# Altium project PCB_Project.PrjPcb
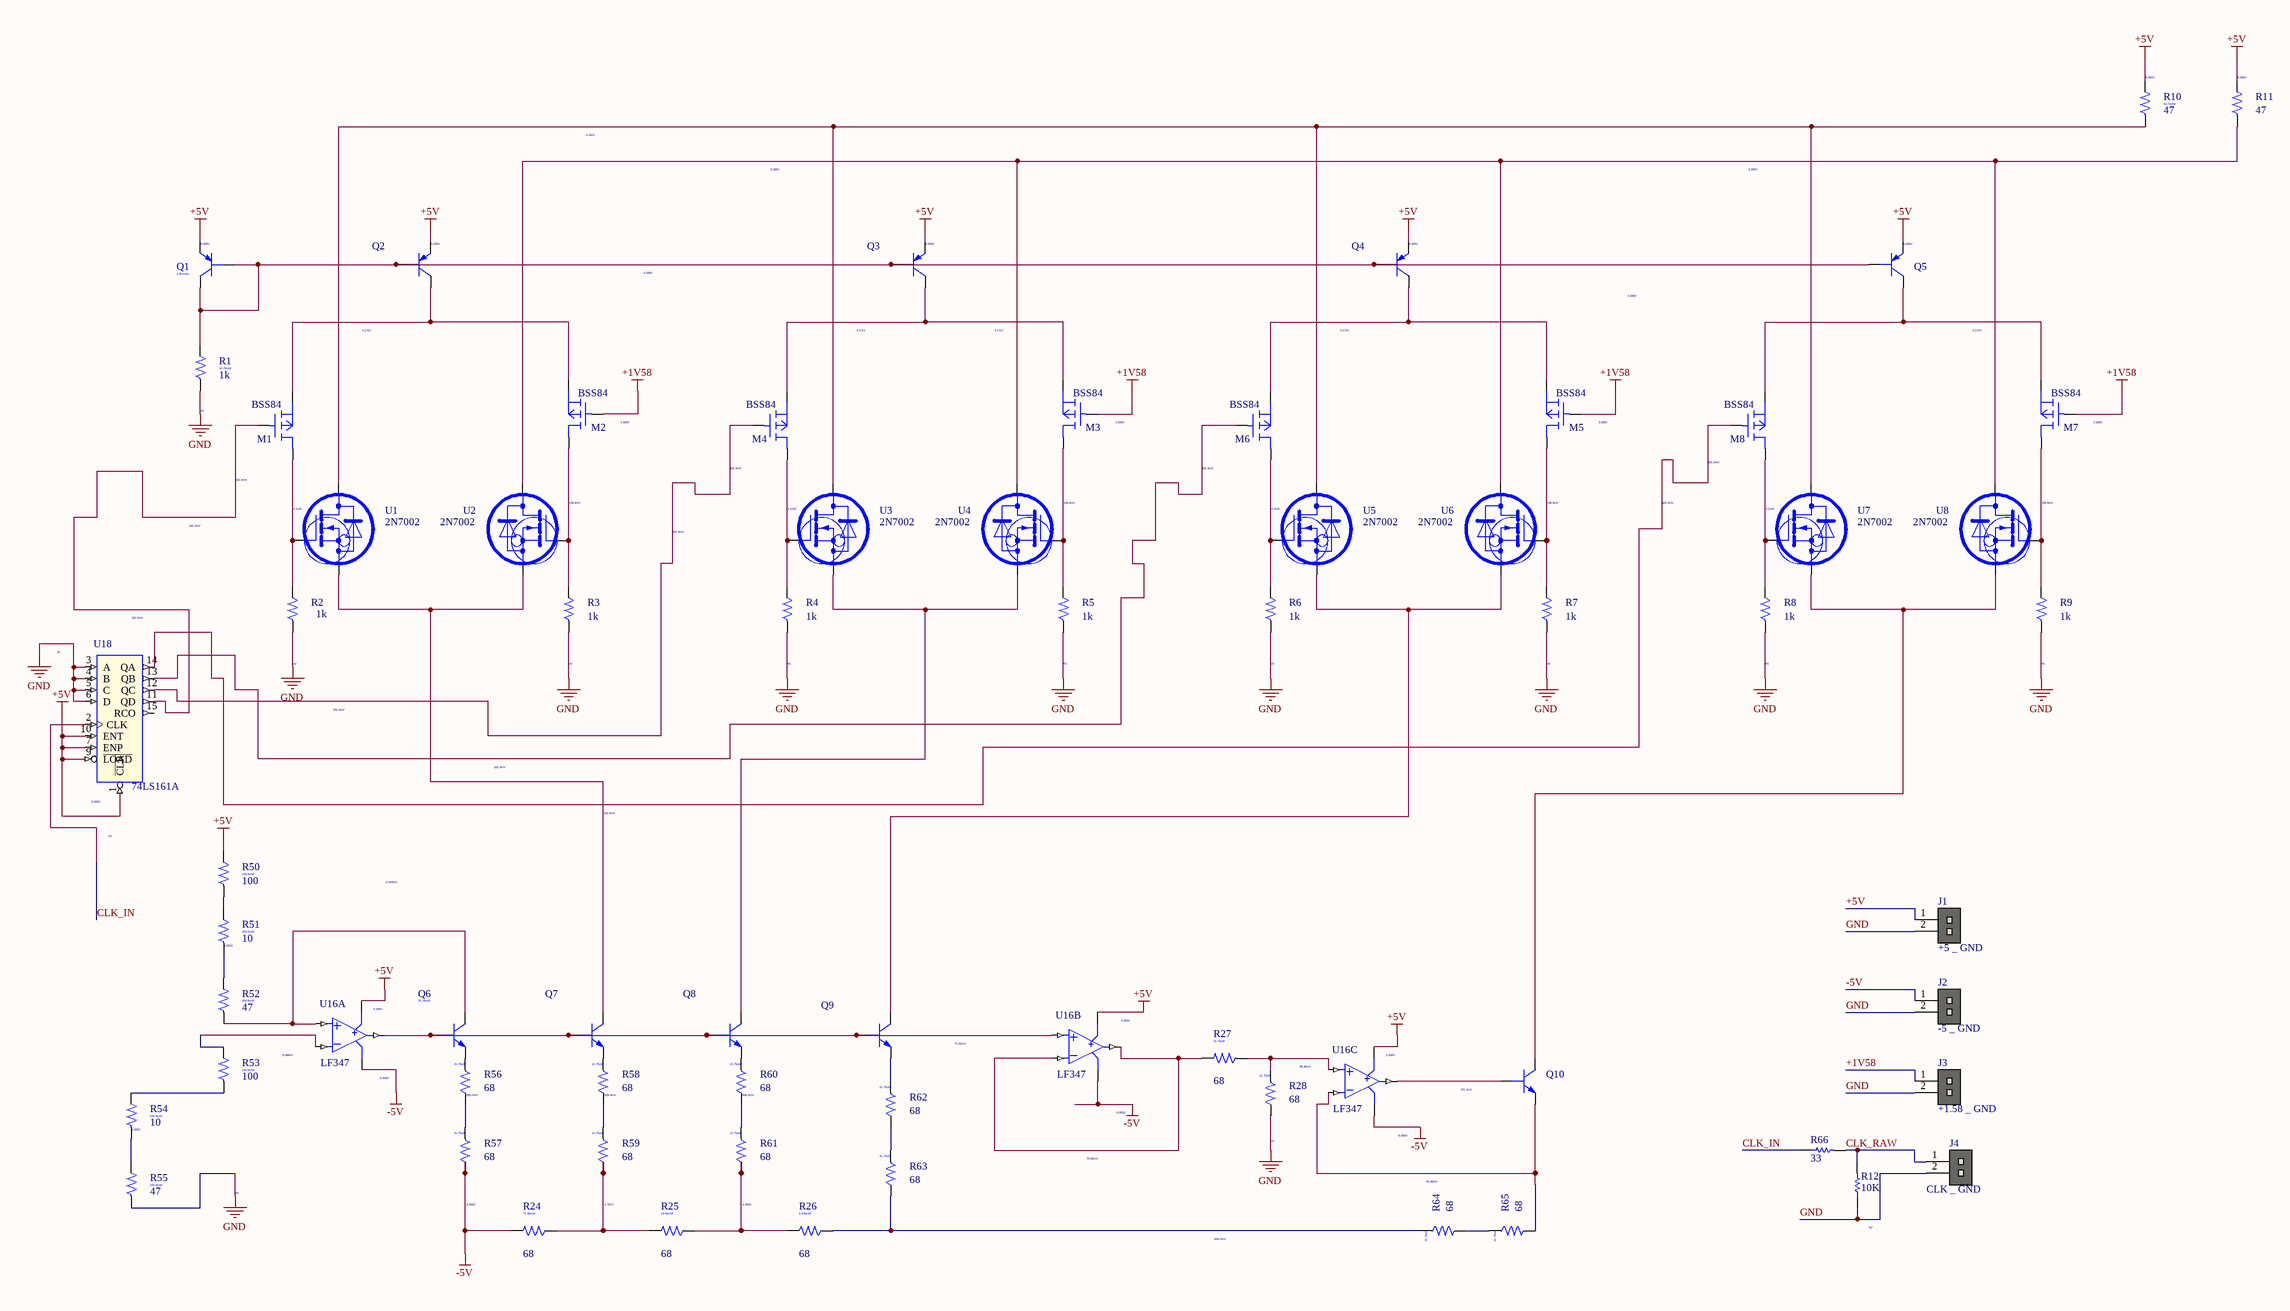
[diagram p0: PAGE1.SchDoc]
1 sheet, 66 parts. Net scope: global (net labels, ports and power ports of the same name join across sheets).
Board file: PCB1.PcbDoc

## Sheet PAGE1.SchDoc
size 513 x 386 mm; SheetNumber: 1; SheetTotal: 1

### Parts
J1  +5 _ GND  [MHDR1X02-254P]
J2  -5 _ GND  [MHDR1X02-254P]
J3  +1.58 _ GND  [MHDR1X02-254P]
J4  CLK _ GND  [MHDR1X02-254P]
M1  BSS84  [SOT-23]
M2  BSS84  [SOT-23]
M3  BSS84  [SOT-23]
M4  BSS84  [SOT-23]
M5  BSS84  [SOT-23]
M6  BSS84  [SOT-23]
M7  BSS84  [SOT-23]
M8  BSS84  [SOT-23]
Q1  BiasValue Power: 2.857mW  [SOT-23]  (hidden comment: BC857)
Q2  BC857  [SOT-23]  (value not drawn)
Q3  BC857  [SOT-23]  (value not drawn)
Q4  BC857  [SOT-23]  (value not drawn)
Q5  BC857  [SOT-23]  (value not drawn)
Q6  BiasValue Power: 20.78mW  [SOT-23]  (hidden comment: BC847)
Q7  BC847  [SOT-23]  (value not drawn)
Q8  BC847  [SOT-23]  (value not drawn)
Q9  BC847  [SOT-23]  (value not drawn)
Q10  BC847  [SOT-23]  (value not drawn)
R1  1k  BiasValue Power: 18.75mW  [R0603]
R2  1k  [R0603]
R3  1k  [R0603]
R4  1k  [R0603]
R5  1k  [R0603]
R6  1k  [R0603]
R7  1k  [R0603]
R8  1k  [R0603]
R9  1k  [R0603]
R10  47  BiasValue Power: 53.73mW  [R0805]
R11  47  [R0805]
R12  10K  [RESC3413X04N]
R24  68  BiasValue Power: 73.36mW  [R0805]
R25  68  BiasValue Power: 19.96mW  [R0805]
R26  68  BiasValue Power: 6.548mW  [R0805]
R27  68  BiasValue Power: 21.75uW  [R0805]
R28  68  BiasValue Power: 21.75uW  [R0805]
R50  100  BiasValue Power: 159.6mW  [R1206]
R51  10  BiasValue Power: 159.6mW  [R0805]
R52  47  BiasValue Power: 159.6mW  [R0805]
R53  100  BiasValue Power: 159.6mW  [R1206]
R54  10  BiasValue Power: 159.6mW  [R0805]
R55  47  BiasValue Power: 159.6mW  [R0805]
R56  68  BiasValue Power: 21.75uW  [R0805]
R57  68  BiasValue Power: 21.75uW  [R0805]
R58  68  BiasValue Power: 21.75uW  [R0805]
R59  68  BiasValue Power: 21.75uW  [R0805]
R60  68  BiasValue Power: 21.75uW  [R0805]
R61  68  BiasValue Power: 21.75uW  [R0805]
R62  68  BiasValue Power: 21.75uW  [R0805]
R63  68  BiasValue Power: 21.75uW  [R0805]
R64  68  BiasValue Power: 21.75uW  [R0805]
R65  68  BiasValue Power: 21.75uW  [R0805]
R66  value 33  [SMD-0805-RES]  (hidden comment: Resistor SMD 0805)
U1  2N7002  [SOT-23]
U2  2N7002  [SOT-23]
U3  2N7002  [SOT-23]
U4  2N7002  [SOT-23]
U5  2N7002  [SOT-23]
U6  2N7002  [SOT-23]
U7  2N7002  [SOT-23]
U8  2N7002  [SOT-23]
U16  LF347  [DIP14]  (parts A,B,C of 4)
U18  74LS161A  [DIP 16]

### Nets
+1V58: J3.1 M2.1(g) M3.1(g) M5.1(g) M7.1(g)
+5V: J1.1 Q1.1(E) Q2.1(E) Q3.1(E) Q4.1(E) Q5.1(E) R10.2 R11.2 R50.2 U16.4(PVSS) U16.PVSS U18.1(~{CLR}) U18.7(ENP) U18.9(~{LOAD}) U18.10(ENT)
-5V: J2.1 R24.2 R57.2 U16.11(NVSS) U16.NVSS
GND: J1.2 J2.2 J3.2 J4.2 R1.1 R2.1 R3.1 R4.1 R5.1 R6.1 R7.1 R8.1 R9.1 R12.1 R28.2 R55.1 U18.3(A) U18.4(B) U18.5(C) U18.6(D)
CLK_IN: R66.1 U18.2(CLK)
CLK_RAW: J4.1 R12.2 R66.2
NetM1_1: M1.1(g) U18.11(QD)
NetM1_2: M1.2(d) R2.2 U1.2(GATE)
NetM1_3: M1.3(s) M2.3(s) Q2.3(C)
NetM2_2: M2.2(d) R3.2 U2.2(GATE)
NetM3_2: M3.2(d) R5.2 U4.2(GATE)
NetM3_3: M3.3(s) M4.3(s) Q3.3(C)
NetM4_1: M4.1(g) U18.12(QC)
NetM4_2: M4.2(d) R4.2 U3.2(GATE)
NetM5_2: M5.2(d) R7.2 U6.2(GATE)
NetM5_3: M5.3(s) M6.3(s) Q4.3(C)
NetM6_1: M6.1(g) U18.13(QB)
NetM6_2: M6.2(d) R6.2 U5.2(GATE)
NetM7_2: M7.2(d) R9.2 U8.2(GATE)
NetM7_3: M7.3(s) M8.3(s) Q5.3(C)
NetM8_1: M8.1(g) U18.14(QA)
NetM8_2: M8.2(d) R8.2 U7.2(GATE)
NetQ1_2: Q1.2(B) Q1.3(C) Q2.2(B) Q3.2(B) Q4.2(B) Q5.2(B) R1.2
NetQ6_1: Q6.1(E) R56.1
NetQ6_2: Q6.2(B) Q7.2(B) Q8.2(B) Q9.2(B) U16.7(OUT) U16.12(PIN)
NetQ6_3: Q6.3(C) R52.1 U16.5(PIN)
NetQ7_1: Q7.1(E) R58.1
NetQ7_3: Q7.3(C) U1.3(SOURCE) U2.3(SOURCE)
NetQ8_1: Q8.1(E) R60.1
NetQ8_3: Q8.3(C) U3.3(SOURCE) U4.3(SOURCE)
NetQ9_1: Q9.1(E) R62.1
NetQ9_3: Q9.3(C) U5.3(SOURCE) U6.3(SOURCE)
NetQ10_1: Q10.1(E) R65.2 U16.2(NIN)
NetQ10_2: Q10.2(B) U16.1(OUT)
NetQ10_3: Q10.3(C) U7.3(SOURCE) U8.3(SOURCE)
NetR10_1: R10.1 U1.1(DRAIN) U3.1(DRAIN) U5.1(DRAIN) U7.1(DRAIN)
NetR11_1: R11.1 U2.1(DRAIN) U4.1(DRAIN) U6.1(DRAIN) U8.1(DRAIN)
NetR24_1: R24.1 R25.2 R59.2
NetR25_1: R25.1 R26.2 R61.2
NetR26_1: R26.1 R63.2 R64.1
NetR27_1: R27.1 R28.1 U16.3(PIN)
NetR27_2: R27.2 U16.13(NIN) U16.14(OUT)
NetR50_1: R50.1 R51.2
NetR51_1: R51.1 R52.2
NetR53_1: R53.1 R54.2
NetR53_2: R53.2 U16.6(NIN)
NetR54_1: R54.1 R55.2
NetR56_2: R56.2 R57.1
NetR58_2: R58.2 R59.1
NetR60_2: R60.2 R61.1
NetR62_2: R62.2 R63.1
NetR64_2: R64.2 R65.1

Not connected (* = marked no-connect by the designer): U18 8(GND) 15(RCO) 16(VCC)

### Notes on the sheet
- (near R10) 5.000V
- (near R11) 5.000V
- 3.361V
- 5.000V
- (near Q1) 5.000V
- (near Q2) 5.000V
- 4.330V
- (near Q3) 5.000V
- (near Q4) 5.000V
- (near Q5) 5.000V
- 4.171V
- (near R1) 0V
- (near M2) 2.500V
- (near M3) 2.500V
- (near M5) 2.500V
- (near M7) 2.500V
- 101.5mV
- (near U1) 4.114V
- (near U2) 148.6mV
- (near M4) 101.5mV
- (near U3) 4.114V
- (near U4) 148.6mV
- (near M6) 101.5mV
- (near U5) 4.114V
- (near U6) 148.6mV
- (near M8) 101.5mV
- (near U7) 4.114V
- (near U8) 148.6mV
- (near U18) 0V
- (near R2) 0V
- (near R3) 0V
- (near R4) 0V
- (near R5) 0V
- (near R6) 0V
- (near R7) 0V
- (near R8) 0V
- (near R9) 0V
- (near U18) 5.000V
- 0V
- -5.004mV
- (near R51) 5.000V
- (near U16) 5.000V
- (near U16) -5.996nV
- (near U16) -5.000V
- (near R56) -655.2mV
- (near R58) -629.4mV
- (near R60) -606.0mV
- 71.91mV
- 38.46mV
- (near Q10) 721.1mV
- (near R54) 5.000V
- (near R28) 0V
- -5.000V
- -2.767V
- -1.602V
- 76.92mV
- 43.46mV
- -934.2mV
- (near R12) 0V

### Library data of the parts
J1-J4 = Header 2: Header, 2-Pin; ComponentLinkp-URL: https://www.smartw.ir/; DatasheetVersion: 2020
M1-M8 = BSS84: Schematics' Source Library: H:\Fertige_Modelle\BSx\Files\Bss_l0_2.slb; PSpiceTemplate: X^@REFDES %g %s %d @MODEL
Q1-Q5 = BC857: PSpiceTemplate: Q^@REFDES %C %B %E @MODEL ?AREA/@AREA/; PCB Footprint: sot23
Q6-Q10 = BC847: PSpiceTemplate: Q^@REFDES %C %B %E @MODEL ?AREA/@AREA/; PCB Footprint: sot23
R1-R9 R24-R28 R56-R65 = R: PSpice Model Type: 0011; TC2: 0; POWER: RMAX; MAX_TEMP: RTMAX; SLOPE: RSMAX; VOLTAGE: RVMAX; PSpiceTemplate: R^@REFDES %1 %2 ?TOLERANCE|R^@REFDES| @VALUE TC=@TC1,@TC2 ?TOLERANCE|\n.model R^@REFDES RES R=1 DEV=@TOLERANCE% TC1=@TC1 TC2=@TC2|; DIST: FLAT; PCB Footprint: AXRC05; TC1: 0
  R1-R9: Value: 1k
  R24-R28 R56-R65: Value: 68
R10 R11 = R: PSpice Model Type: 0011; TC2: 0; POWER: RMAX; MAX_TEMP: RTMAX; SLOPE: RSMAX; VOLTAGE: RVMAX; PSpiceTemplate: R^@REFDES %1 %2 ?TOLERANCE|R^@REFDES| @VALUE TC=@TC1,@TC2 ?TOLERANCE|\n.model R^@REFDES RES R=1 DEV=@TOLERANCE% TC1=@TC1 TC2=@TC2|; DIST: FLAT; PCB Footprint: AXRC05; Value: 50; TC1: 0
R12 = RES 0805 0.125W: RES 0805; Designer: Abbas Basereh; Desc.: RES SMD 0805; Data: 16-12-2016
R50-R55 = R: PSpice Model Type: 0011; TC2: 0; POWER: RMAX; MAX_TEMP: RTMAX; SLOPE: RSMAX; VOLTAGE: RVMAX; PSpiceTemplate: R^@REFDES %1 %2 ?TOLERANCE|R^@REFDES| @VALUE TC=@TC1,@TC2 ?TOLERANCE|\n.model R^@REFDES RES R=1 DEV=@TOLERANCE% TC1=@TC1 TC2=@TC2|; DIST: FLAT; PCB Footprint: AXRC05; Value: 157; TC1: 0
U1-U8 = 2N7002: PSpiceTemplate: X^@REFDES %DRAIN %GATE %SOURCE @MODEL; PCB Footprint: SOT23
U16 = LF347: TOL_ON_OFF: ON; PCB Footprint: DIP14_3
U18 = 74LS161A: IO_LEVEL: 0; PSpiceTemplate: X^@REFDES %CLK %ENP %ENT %C\L\R\ %L\O\A\D\ %A %B %C %D %QA %QB %QC %QD %RCO %VCC %GND @MODEL PARAMS:\n+ IO_LEVEL=@IO_LEVEL MNTYMXDLY=@MNTYMXDLY; PCB Footprint: DIP10016W300L900; MNTYMXDLY: 0
R66 = Resistor SMD 0805: DatasheetVersion: 2021; ComponentLink1Description: Website Smart World; ComponentLink1URL: https://www.smartw.ir/; ComponentLink2Description: Telegram; ComponentLink2URL: https://t.me/altium_smartw; ComponentLink3Description: Instagram; ComponentLink3URL: https://Instagram.com/smartgw.ir